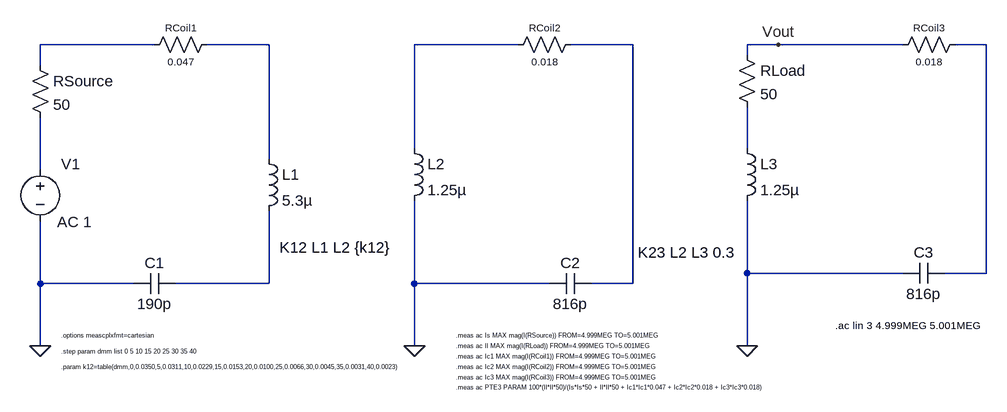
[diagram p0: schematic 3-coil_resonant_part-C.asc]
3-coil_resonant_part-C.asc, the LTspice schematic file:
Version 4.1
SHEET 1 1468 680
WIRE 144 -48 -32 -48
WIRE 320 -48 224 -48
WIRE 704 -48 544 -48
WIRE 880 -48 784 -48
WIRE 1104 -48 1056 -48
WIRE 1296 -48 1104 -48
WIRE 1424 -48 1376 -48
WIRE 1056 -32 1056 -48
WIRE -32 -16 -32 -48
WIRE 544 112 544 -48
WIRE 1056 112 1056 48
WIRE 320 128 320 -48
WIRE -32 144 -32 64
WIRE 1056 304 1056 192
WIRE 1296 304 1056 304
WIRE 1424 304 1424 -48
WIRE 1424 304 1360 304
WIRE -32 320 -32 224
WIRE 112 320 -32 320
WIRE 320 320 320 208
WIRE 320 320 176 320
WIRE 544 320 544 192
WIRE 752 320 544 320
WIRE 880 320 880 -48
WIRE 880 320 816 320
WIRE -32 416 -32 320
WIRE 544 416 544 320
WIRE 1056 416 1056 304
FLAG -32 416 0
FLAG 544 416 0
FLAG 1056 416 0
FLAG 1104 -48 Vout
SYMBOL res -48 -32 R0
SYMATTR InstName RSource
SYMATTR Value 50
SYMBOL res 1040 -48 R0
SYMATTR InstName RLoad
SYMATTR Value 50
SYMBOL ind 304 112 R0
SYMATTR InstName L1
SYMATTR Value 5.3µ
SYMATTR Type ind
SYMATTR SpiceLine Rser=1m
SYMBOL ind 528 96 R0
SYMATTR InstName L2
SYMATTR Value 1.25µ
SYMATTR Type ind
SYMATTR SpiceLine Rser=1m
SYMBOL ind 1040 96 R0
SYMATTR InstName L3
SYMATTR Value 1.25µ
SYMATTR Type ind
SYMATTR SpiceLine Rser=1m
SYMBOL cap 176 304 R90
WINDOW 0 0 32 VBottom 2
WINDOW 3 32 32 VTop 2
SYMATTR InstName C1
SYMATTR Value 190p
SYMBOL cap 816 304 R90
WINDOW 0 0 32 VBottom 2
WINDOW 3 32 32 VTop 2
SYMATTR InstName C2
SYMATTR Value 816p
SYMBOL cap 1360 288 R90
WINDOW 0 0 32 VBottom 2
WINDOW 3 32 32 VTop 2
SYMATTR InstName C3
SYMATTR Value 816p
SYMBOL voltage -32 128 R0
WINDOW 123 26 97 Left 2
WINDOW 39 0 0 Left 0
WINDOW 0 32 8 Left 2
SYMATTR Value2 AC 1
SYMATTR InstName V1
SYMATTR Value ""
SYMBOL res 240 -64 R90
WINDOW 0 0 56 VBottom 1
WINDOW 3 32 56 VTop 1
SYMATTR InstName RCoil1
SYMATTR Value 0.047
SYMBOL res 800 -64 R90
WINDOW 0 0 56 VBottom 1
WINDOW 3 32 56 VTop 1
SYMATTR InstName RCoil2
SYMATTR Value 0.018
SYMBOL res 1392 -64 R90
WINDOW 0 0 56 VBottom 1
WINDOW 3 32 56 VTop 1
SYMATTR InstName RCoil3
SYMATTR Value 0.018
TEXT 336 264 Left 2 !K12 L1 L2 {k12}
TEXT 888 272 Left 2 !K23 L2 L3 0.3
TEXT 0 400 Left 0 !.options meascplxfmt=cartesian
TEXT 1192 384 Left 1 !.ac lin 3 4.999MEG 5.001MEG
TEXT 0 424 Left 0 !.step param dmm list 0 5 10 15 20 25 30 35 40
TEXT 0 448 Left 0 !.param k12=table(dmm,0,0.0350,5,0.0311,10,0.0229,15,0.0153,20,0.0100,25,0.0066,30,0.0045,35,0.0031,40,0.0023)
TEXT 608 400 Left 0 !.meas ac Is MAX mag(I(RSource)) FROM=4.999MEG TO=5.001MEG
TEXT 608 416 Left 0 !.meas ac Il MAX mag(I(RLoad)) FROM=4.999MEG TO=5.001MEG
TEXT 608 432 Left 0 !.meas ac Ic1 MAX mag(I(RCoil1)) FROM=4.999MEG TO=5.001MEG
TEXT 608 448 Left 0 !.meas ac Ic2 MAX mag(I(RCoil2)) FROM=4.999MEG TO=5.001MEG
TEXT 608 464 Left 0 !.meas ac Ic3 MAX mag(I(RCoil3)) FROM=4.999MEG TO=5.001MEG
TEXT 608 480 Left 0 !.meas ac PTE3 PARAM 100*(Il*Il*50)/(Is*Is*50 + Il*Il*50 + Ic1*Ic1*0.047 + Ic2*Ic2*0.018 + Ic3*Ic3*0.018)

The netlist it stands for:
* 3-coil_resonant_part-C.asc
RSource N001 N007 50
RLoad Vout N006 50
L1 N002 N008 5.3µ Rser=1m
L2 N003 0 1.25µ Rser=1m
L3 N006 0 1.25µ Rser=1m
C1 N008 0 190p
C2 N004 0 816p
C3 N005 0 816p
V1 N007 0 AC 1
RCoil1 N002 N001 0.047
RCoil2 N004 N003 0.018
RCoil3 N005 Vout 0.018
K12 L1 L2 {k12}
K23 L2 L3 0.3
.options meascplxfmt=cartesian
.ac lin 3 4.999MEG 5.001MEG
.step param dmm list 0 5 10 15 20 25 30 35 40
.param k12=table(dmm,0,0.0350,5,0.0311,10,0.0229,15,0.0153,20,0.0100,25,0.0066,30,0.0045,35,0.0031,40,0.0023)
.meas ac Is MAX mag(I(RSource)) FROM=4.999MEG TO=5.001MEG
.meas ac Il MAX mag(I(RLoad)) FROM=4.999MEG TO=5.001MEG
.meas ac Ic1 MAX mag(I(RCoil1)) FROM=4.999MEG TO=5.001MEG
.meas ac Ic2 MAX mag(I(RCoil2)) FROM=4.999MEG TO=5.001MEG
.meas ac Ic3 MAX mag(I(RCoil3)) FROM=4.999MEG TO=5.001MEG
.meas ac PTE3 PARAM 100*(Il*Il*50)/(Is*Is*50 + Il*Il*50 + Ic1*Ic1*0.047 + Ic2*Ic2*0.018 + Ic3*Ic3*0.018)
.backanno
.end